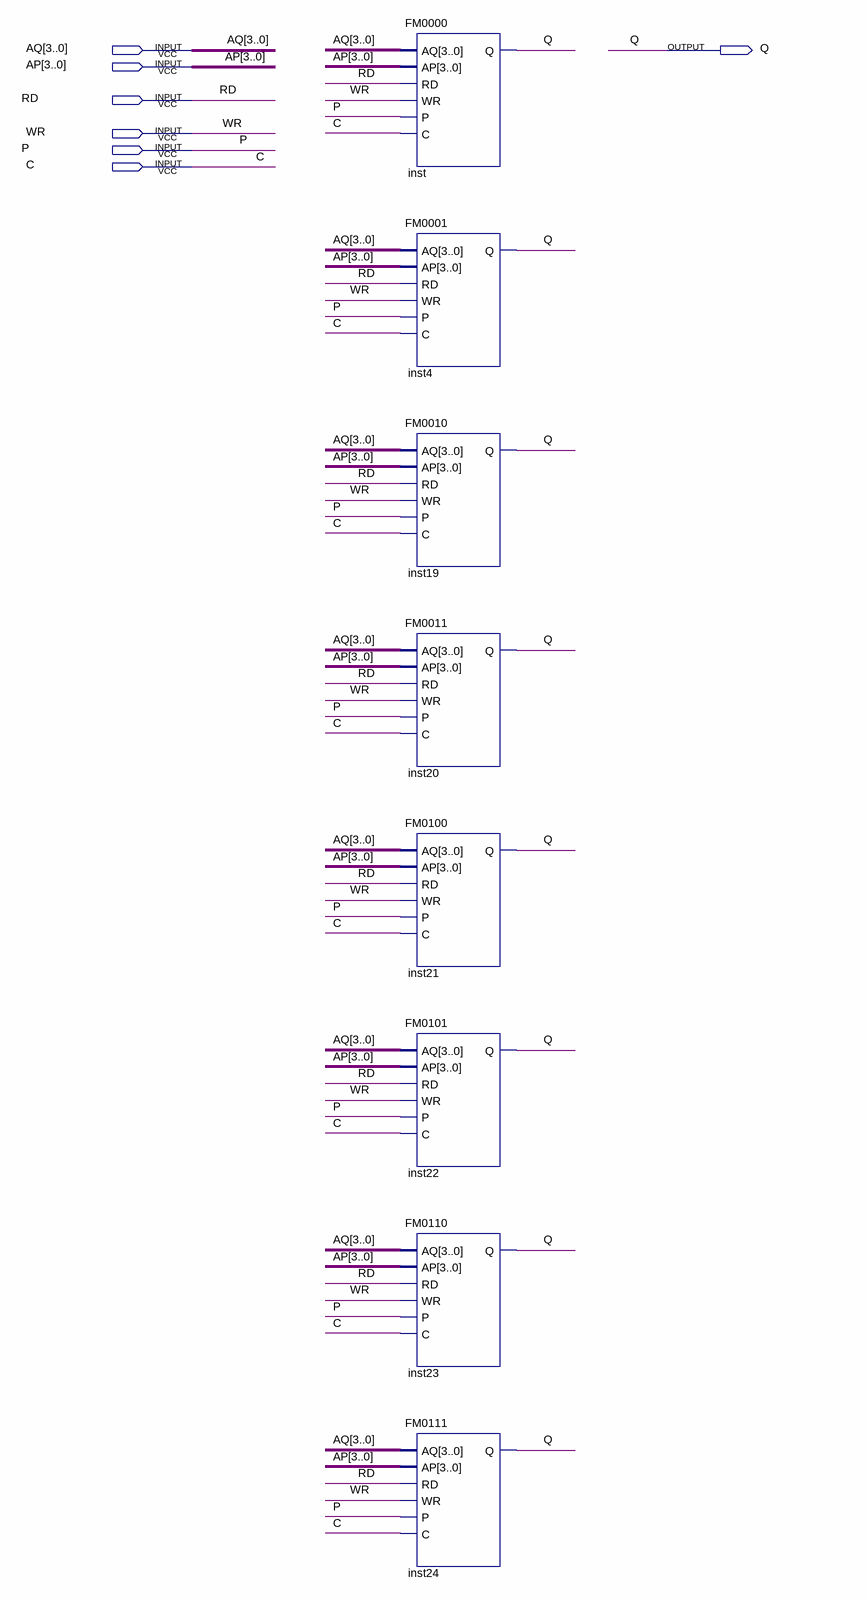
[diagram p0: schematic sheet]
// Quartus schematic FM_FULL.bdf as structural Verilog: 8 symbols, 7 pins
module FM_FULL (
  input  [3:0] AQ,
  input  [3:0] AP,
  input  RD,
  input  WR,
  input  P,
  input  C,
  output Q
);

  FM0000 inst (.AQ(AQ), .AP(AP), .RD(RD), .WR(WR), .P(P), .C(C), .Q(Q));
  FM0001 inst4 (.AQ(AQ), .AP(AP), .RD(RD), .WR(WR), .P(P), .C(C), .Q(Q));
  FM0010 inst19 (.AQ(AQ), .AP(AP), .RD(RD), .WR(WR), .P(P), .C(C), .Q(Q));
  FM0011 inst20 (.AQ(AQ), .AP(AP), .RD(RD), .WR(WR), .P(P), .C(C), .Q(Q));
  FM0100 inst21 (.AQ(AQ), .AP(AP), .RD(RD), .WR(WR), .P(P), .C(C), .Q(Q));
  FM0101 inst22 (.AQ(AQ), .AP(AP), .RD(RD), .WR(WR), .P(P), .C(C), .Q(Q));
  FM0110 inst23 (.AQ(AQ), .AP(AP), .RD(RD), .WR(WR), .P(P), .C(C), .Q(Q));
  FM0111 inst24 (.AQ(AQ), .AP(AP), .RD(RD), .WR(WR), .P(P), .C(C), .Q(Q));
endmodule
